# Altium project TimeDrive.PrjPcb (part 2 of 2)

## Sheet 12-UWB-Power.SchDoc
size A; SheetNumber: 12; SheetTotal: 16
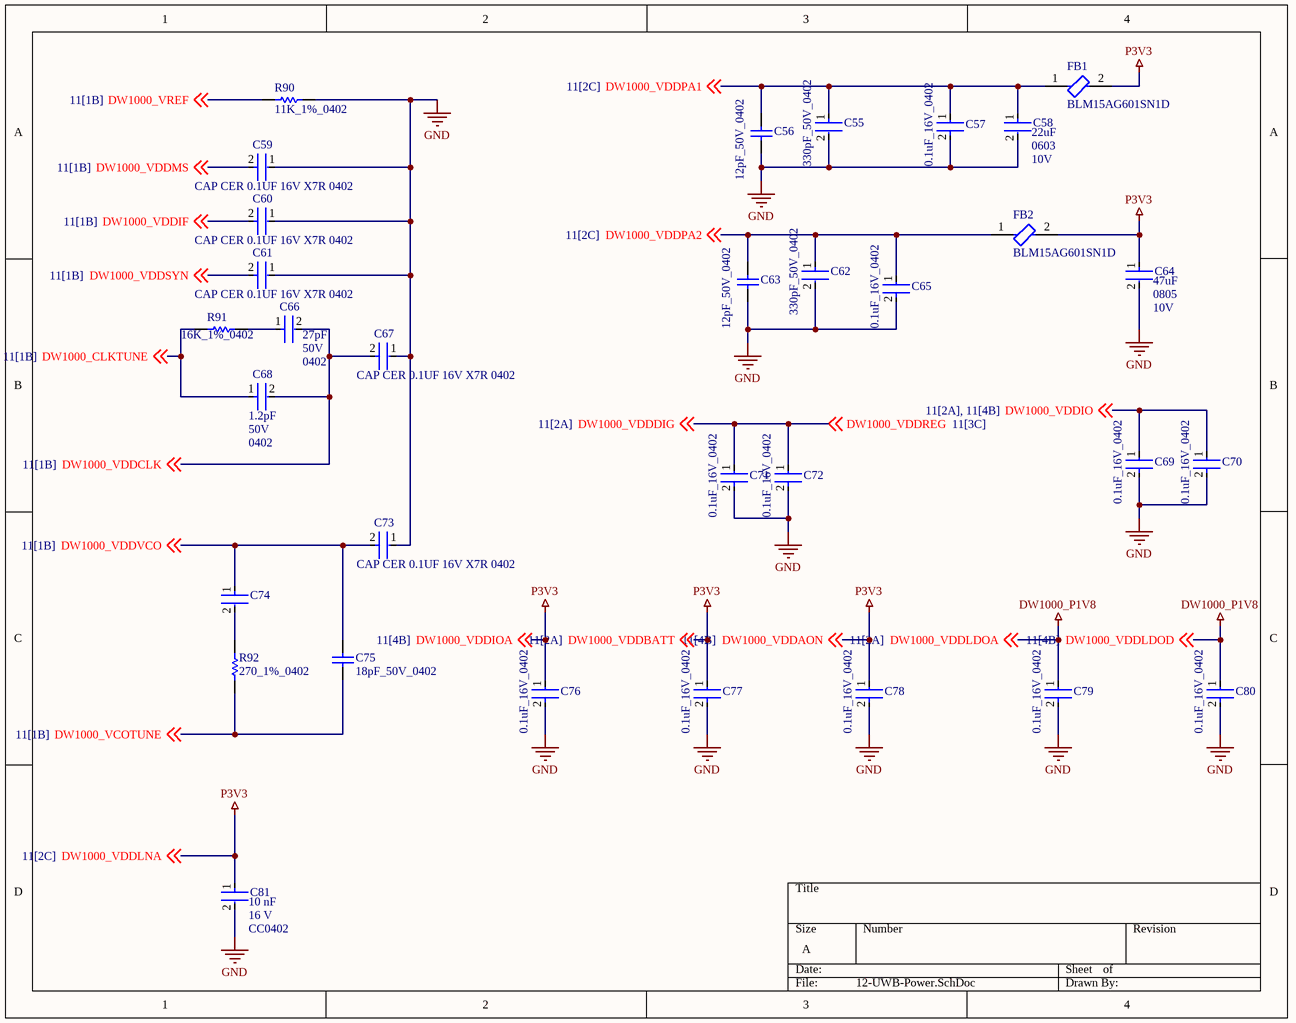
[diagram p6: 12-UWB-Power.SchDoc]

### Parts
C55  330pF_50V_0402  [FP-GRM155-0_05-MFG]
C56  12pF_50V_0402  [CAPC1005X55X25LL05T05]
C57  0.1uF_16V_0402  [FP-GRM15-MFG]
C58  Capacitance: 22uF  Voltage Rating: 10V  Case Code (Imperial): 0603  [FP-GRM188-0_2-IPC_C]  (hidden comment: GRM188R61A226ME15D)
C59  GRM155R71C104KA88D  [FP-GRM15-MFG]  (value not drawn)
C60  GRM155R71C104KA88D  [FP-GRM15-MFG]  (value not drawn)
C61  GRM155R71C104KA88D  [FP-GRM15-MFG]  (value not drawn)
C62  330pF_50V_0402  [FP-GRM155-0_05-MFG]
C63  12pF_50V_0402  [CAPC1005X55X25LL05T05]
C64  Capacitance: 47uF  Case Code (Imperial): 0805  Voltage: 10V  [FP-GRM21B-0_2-e0_2_0_7-IPC_A]  (hidden comment: GRM21BR61A476ME15L)
C65  0.1uF_16V_0402  [FP-GRM15-MFG]
C66  Voltage Rating: 50V  Case/Package: 0402  Capacitance: 27pF  [FP-0402-L_1_0_1-W_0_5_0_1-MFG]  (hidden comment: 04025A270JAT2A)
C67  GRM155R71C104KA88D  [FP-GRM15-MFG]  (value not drawn)
C68  Voltage Rating (DC): 50V  Case Code (Imperial): 0402  Capacitance: 1.2pF  [FP-GJM155-0_05-IPC_B]  (hidden comment: GJM1555C1H1R2BB01D)
C69  0.1uF_16V_0402  [FP-GRM15-MFG]
C70  0.1uF_16V_0402  [FP-GRM15-MFG]
C71  0.1uF_16V_0402  [FP-GRM15-MFG]
C72  0.1uF_16V_0402  [FP-GRM15-MFG]
C73  GRM155R71C104KA88D  [FP-GRM15-MFG]  (value not drawn)
C74  C0402C821K5RACTU  [FP-C0402-BB-MFG]  (value not drawn)
C75  18pF_50V_0402  [CAPC1005X55X25NL05T10]
C76  0.1uF_16V_0402  [FP-GRM15-MFG]
C77  0.1uF_16V_0402  [FP-GRM15-MFG]
C78  0.1uF_16V_0402  [FP-GRM15-MFG]
C79  0.1uF_16V_0402  [FP-GRM15-MFG]
C80  0.1uF_16V_0402  [FP-GRM15-MFG]
C81  value 10 nF  Package: CC0402  Voltage Rating: 16 V  [FP-CC0402-MFG]  (hidden comment: CC0402KRX7R7BB103)
FB1  BLM15AG601SN1D  [FP-BLM15-0_05-MFG]
FB2  BLM15AG601SN1D  [FP-BLM15-0_05-MFG]
R90  11K_1%_0402  [RESC1005X40X25LL05T10]
R91  16K_1%_0402  [RESC1005X40X25ML05T10]
R92  270_1%_0402  [RESC1005X40X25ML05T05]

### Nets
DW1000_P1V8: C79.1 C80.1 ; off-sheet DW1000_VDDLDOD, off-sheet DW1000_VDDLDOA  [also labelled DW1000_VDDLDOA, DW1000_VDDLDOD]
GND: C55.2 C56.1 C57.2 C58.2 C59.1 C60.1 C61.1 C62.2 C63.1 C64.2 C65.2 C67.1 C69.2 C70.2 C71.2 C72.2 C73.1 C76.2 C77.2 C78.2 C79.2 C80.2 C81.2 R90.2
P3V3: C64.1 C76.1 C77.1 C78.1 C81.1 FB1.2 FB2.2 ; off-sheet DW1000_VDDLNA, off-sheet DW1000_VDDAON, off-sheet DW1000_VDDIOA, off-sheet DW1000_VDDBATT  [also labelled DW1000_VDDAON, DW1000_VDDBATT, DW1000_VDDIOA, DW1000_VDDLNA]
DW1000_CLKTUNE: C68.1 R91.1 ; off-sheet DW1000_CLKTUNE
DW1000_VCOTUNE: C75.1 R92.1 ; off-sheet DW1000_VCOTUNE
DW1000_VDDCLK: C66.2 C67.2 C68.2 ; off-sheet DW1000_VDDCLK
DW1000_VDDDIG: C71.1 C72.1 ; off-sheet DW1000_VDDREG, off-sheet DW1000_VDDDIG  [also labelled DW1000_VDDREG]
DW1000_VDDIF: C60.2 ; off-sheet DW1000_VDDIF
DW1000_VDDIO: C69.1 C70.1 ; off-sheet DW1000_VDDIO
DW1000_VDDMS: C59.2 ; off-sheet DW1000_VDDMS
DW1000_VDDPA1: C55.1 C56.2 C57.1 C58.1 FB1.1 ; off-sheet DW1000_VDDPA1
DW1000_VDDPA2: C62.1 C63.2 C65.1 FB2.1 ; off-sheet DW1000_VDDPA2
DW1000_VDDSYN: C61.2 ; off-sheet DW1000_VDDSYN
DW1000_VDDVCO: C73.2 C74.1 C75.2 ; off-sheet DW1000_VDDVCO
DW1000_VREF: R90.1 ; off-sheet DW1000_VREF
NetC66_1: C66.1 R91.2
NetC74_2: C74.2 R92.2

### Library data of the parts
C55 C62 = CMP-06035-004830-1: Chip Multilayer Ceramic Capacitors for General Purpose, 0402, 330pF, C0G, 30ppm/°C, 5%, 50V; Insulation Resistance: 10GR; REACH SVHC: No SVHC; Depth: 0.5mm; Voltage Rating (DC): 50V; Number of Pins: 2; Max Operating Temperature: 125°C; Dielectric: C0G; Tolerance: 5%; Package Quantity: 1; Length: 1mm; Thickness: 0.022inch; Case/Package: 0402; Lead Free: Lead Free; Case Code (Imperial): 0402; Material: Ceramic; Voltage Rating: 50V; Voltage: 50V; Radiation Hardening: No; Min Operating Temperature: -55°C; Packaging: Tape and Reel; Capacitance: 330pF; Case Code (Metric): 1005; Width: 0.5mm; Mount: Surface Mount; Height: 0.5mm; Temperature Coefficient: 30ppm/°C; Termination: SMD/SMT
C56 C63 = CMP-2000-06069-1: Chip Capacitor, 12 pF, +/- 5%, 50 V, -55 to 125 degC, 0402 (1005 Metric), RoHS, Tape and Reel; Manufacturer: Yageo; Capacitance: 12pF; Voltage - Rated: 50V; Other Names: 311-1016-6311-1266-6311-1266-6-ND; Catalog Drawings: CC_0402; Featured Product: CommodityMultilayerCeramicCapacitors–CCSeries; Product Training Modules: MultilayerCeramicCapacitors; Online Catalog: CCSeries; Temperature Coefficient: C0G,NP0; Mounting Technology: SurfaceMount; Package Reference: 0402; Lead Style: -; Datasheet URL: http://www.yageo.com/NewPortal/yageodocoutput?fileName=/pdf/MLCC/UPY-GP_NP0_16V-to-50V_14.pdf; Height - Seated (Max): -; Mounting Type: SurfaceMount,MLCC; Series: CC; Standard Package: 1; Manufacturer URL: http://www.yageo.com/; Package / Case: 0402(1005Metric); Features: -; Applications: GeneralPurpose; Family: CeramicCapacitors; Size / Dimension: 0.039"Lx0.020"W(1.00mmx0.50mm); Ratings: -; Package Description: 2-Pin Surface Mount Device, Body 1 x 0.5 mm; Datasheet Version: Rev. 14, 07/2016; Lead Spacing: -; Packaging: Digi-Reel®; Category: Capacitors; Tolerance: ±5%; Thickness (Max): 0.022"(0.55mm); Operating Temperature: -55°C~125°C
C57 C65 C69-C72 C76-C80 = CMP-2100-03641-2: Manufacturer Part Number: GRM155R71C104KA88D; Manufacturer: Murata; Temperature Characteristic: X7R; Standoff Height: 0mm; Tolerance: 10%; Voltage Rating: 16Vdc; Material: Ceramic; Capacitance: 0.10μF; Value: 0.10μF; RoHS: TRUE; Octopart: https://octopart.com/grm155r71c104ka88d-murata-196880; Digikey Description: CAP CER 0.1UF 16V X7R 0402; Device Class L3: Ceramic Capacitors; Height: 0.55mm; ComponentLink2Description: Datasheet; Temperature Range Low: -55°C; Ipc Land Pattern Name: CAPC10050X219; ComponentLink2URL: https://search.murata.co.jp/Ceramy/image/img/A01X/G101/ENG/GRM155R71H471KA01-01A.pdf; Device Class L1: Passive Components; Lead Free: yes; Category: Cap; Package: GRM15; Temperature: -55°C to +125°C; Device Class L2: Capacitors; Temperature Range High: +125°C; Mouser Description: 0402 0.1 uF 16V ±10 % Tolerance X7R SMT Multilayer Ceramic Capacitor
C58 = CMP-2000-06337-3: Chip Multilayer Ceramic Capacitors for General Purpose, 0603, 22uF, X5R, 15%, 20%, 10V; Tolerance: 20%; Weight: 0.000222oz; Material: Ceramic; Depth: 0.8mm; Length: 1.6mm; Termination: SMD/SMT; Packaging: Tape and Reel; Width: 0.8mm; Mount: Surface Mount; Voltage Rating (DC): 10V; Case/Package: 0603; Thickness: 0.039inch; REACH SVHC: No SVHC; Dielectric: X5R; Height: 0.8mm; Package Quantity: 4000; Case Code (Metric): 1608; Min Operating Temperature: -55°C; Lead Free: Lead Free; Max Operating Temperature: 85°C
C59-C61 C67 C73 = CMP-2100-03641-2: CAP CER 0.1UF 16V X7R 0402; Manufacturer: Murata; Standoff Height: 0mm; Tolerance: 10%; Voltage Rating: 16Vdc; Material: Ceramic; Capacitance: 0.10μF; Value: 0.10μF; RoHS: TRUE; Manufacturer Part Number: GRM155R71C104KA88D; Temperature Characteristic: X7R; Octopart: https://octopart.com/grm155r71c104ka88d-murata-196880; Digikey Description: CAP CER 0.1UF 16V X7R 0402; Device Class L3: Ceramic Capacitors; Height: 0.55mm; ComponentLink2Description: Datasheet; Temperature Range Low: -55°C; Ipc Land Pattern Name: CAPC10050X219; ComponentLink2URL: https://search.murata.co.jp/Ceramy/image/img/A01X/G101/ENG/GRM155R71H471KA01-01A.pdf; Device Class L1: Passive Components; Lead Free: yes; Category: Cap; Package: GRM15; Temperature: -55°C to +125°C; Device Class L2: Capacitors; Temperature Range High: +125°C; Mouser Description: 0402 0.1 uF 16V ±10 % Tolerance X7R SMT Multilayer Ceramic Capacitor
C64 = CMP-2000-06341-2: Chip Multilayer Ceramic Capacitors for General Purpose, 0805, 47uF, X5R, 15%, 20%, 10V; Dissipation Factor: 0.035%; Length: 2mm; Voltage Rating: 10V; Mount: Surface Mount; Width: 0.049inch; Voltage Rating (DC): 10V; Lead Free: Lead Free; REACH SVHC: No SVHC; Termination: SMD/SMT; Case/Package: 0805; Dielectric: X5R; Packaging: Tape and Reel; Max Operating Temperature: 85°C; Tolerance: 20%; Thickness: 0.057inch; Dielectric Material: Ceramic; Min Operating Temperature: -55°C; Height: 1.25mm; Case Code (Metric): 2012; Depth: 1.25mm
C66 = CMP-2008-02622-4: General Purpose Ceramic Capacitor, 0402, 27pF, 5%, C0G, 30ppm/°C, 50V; Voltage Rating (DC): 50V; Number of Pins: 2; Lead Free: Lead Free; RoHS Compliant: Yes; Dielectric Material: Ceramic; Height: 0.5mm; Voltage: 50V; Length: 1mm; Tolerance: 5%; Case Code (Imperial): 0402; Min Operating Temperature: -55°C; Max Operating Temperature: 125°C; Termination: SMD/SMT; Depth: 0.5mm; Width: 0.02inch; Dielectric: C0G; Radiation Hardening: No; Package Quantity: 1; Packaging: Tape and Reel; REACH SVHC: No SVHC; Thickness: 0.022inch; Temperature Coefficient: 0ppm/°C; Mount: Surface Mount; Case Code (Metric): 1005; Contact Plating: Tin
C68 = CMP-2008-03813-2: Multi-Layer Ceramic Capacitor 1.2pF C0G  ±0.1pF 0402 Paper T/R; Temperature Coefficient: 30ppm/°C; Case Code (Metric): 1005; Lead Free: Lead Free; Packaging: Tape and Reel; Radiation Hardening: No; Dielectric: C0G; Weight: 2.3E-05oz; Width: 0.5mm; Case/Package: 0402; Length: 1mm; Voltage Rating: 50V; Number of Pins: 2; Depth: 0.5mm; Thickness: 0.022inch; Voltage: 50V; Package Quantity: 10000; Max Operating Temperature: 125°C; Height: 0.5mm; REACH SVHC: No SVHC; Mount: Surface Mount; Min Operating Temperature: -55°C; Termination: SMD/SMT; Lead Pitch: 0.3mm
C74 = CMP-2008-03258-2: CAP CER 820PF 50V 10% X7R 0402; Manufacturer: Kemet; Temperature Coefficient: 15%; Tolerance: 0.1; Material: Ceramic; Lead Free: Yes; ComponentLink2Description: Datasheet; Manufacturer Part Number: C0402C821K5RACTU; Device Class L1: Passive Components; Device Class L2: Capacitors; ComponentLink2URL: https://content.kemet.com/datasheets/KEM_C1002_X7R_SMD.pdf; Temperature Range High: +125°C; Device Class L3: Ceramic Capacitors; Automotive: No; Value: 820 pF; Temperature Characteristic: X7R; Temperature Range Low: -55°C; Height: 0.55mm; Package: C0402-BB; Temperature: -55°C to +125°C; Capacitance: 820 pF; Category: Cap; Ipc Land Pattern Name: CAPC10050X50; Digikey Description: CAP CER 820PF 50V 10% X7R 0402; RoHS: TRUE; Octopart: https://octopart.com/c0402c821k5ractu-kemet-10304767; Mouser Description: Multilayer Ceramic Capacitors MLCC - SMD/SMT 50volts 820pF X7R 10%; Voltage Rating: 50 V
C75 = CMP-2008-03918-1: Part Number: GRM1555C1H180JA01D; Manufacturer: Murata
C81 = CMP-03422-000501-1: CAP CER 10000PF 16V X7R 0402; Manufacturer: YAGEO; Automotive Grade: NA; Material: Ceramic; Tolerance: 0.1; Temperature Coefficient: 30ppm/°C; Temperature Range Low: -55°C; Temperature Range High: +125°C; Mouser Description: 0402 10 nF 16 V ±10 % Tolerance X7R SMT Multilayer Ceramic Capacitor; Footprint Url: http://www.yageo.com/exep/pages/download/literatures/UPY-C_GEN_24.pdf; Category: Cap; RoHS: TRUE; Capacitance: 10 nF; Manufacturer Part Number: CC0402KRX7R7BB103; ComponentLink2Description: Datasheet; Ipc Land Pattern Name: CAPC10050X50; Automotive: No; ComponentLink2URL: http://www.yageo.com/documents/recent/UPY-GP_NP0_16V-to-50V_16.pdf; Device Class L1: Passive Components; Height: 0.55mm; Temperature Characteristic: X7R; Device Class L3: Ceramic Capacitors; Lead Free: Yes; Device Class L2: Capacitors; Digikey Description: CAP CER 10000PF 16V X7R 0402; Octopart: https://octopart.com/cc0402krx7r7bb103-yageo-192895; Temperature: -55°C to +125°C
FB1 FB2 = CMP-0686-00187-4: Chip Ferrite Bead, 0402, 600Ω @ 100MHz, 0.52Ω, 25%, 300mA; DC Resistance-Max: 600mR; Number of Lines: 1; DC Resistance (DCR): 520mR; Shielding: Unshielded; Impedance: 600R; Material: Steel; Frequency: 100MHz; Lead Free: Lead Free; Max DC Current: 300mA; Test Frequency: 100MHz; Depth: 0.55mm; Length: 1mm; Case Code (Imperial): 0402; Packaging: Tape and Reel; Height: 0.5mm; Max Operating Temperature: 125°C; Military Standard: Not; REACH SVHC: No SVHC; Case Code (Metric): 1005; Series: BLM15AG_SN; Core Material: Ferrite; Termination: SMD/SMT; DC Current: 300mA; Package Quantity: 10000; Width: 0.5mm; RoHS Compliant: Yes; Min Operating Temperature: -55°C; Current Rating: 300mA; Case/Package: 0402; Number of Pins: 2; Radiation Hardening: No; Tolerance: 25%; Number of Circuits: 1; Max Current Rating: 300mA
R90 = CMP-2002-07365-1: Manufacturer: Yageo / Phycomp; Part Number: RC0402FR-0711KL
R91 = CMP-2002-07038-1: Manufacturer: Yageo / Phycomp; Part Number: RC0402FR-0716KL
R92 = CMP-2002-08427-1: Part Number: CRCW0402270RFKED; Manufacturer: Vishay Dale

## Sheet 15-I225-MISC.SchDoc
size A; SheetNumber: 15; SheetTotal: 16
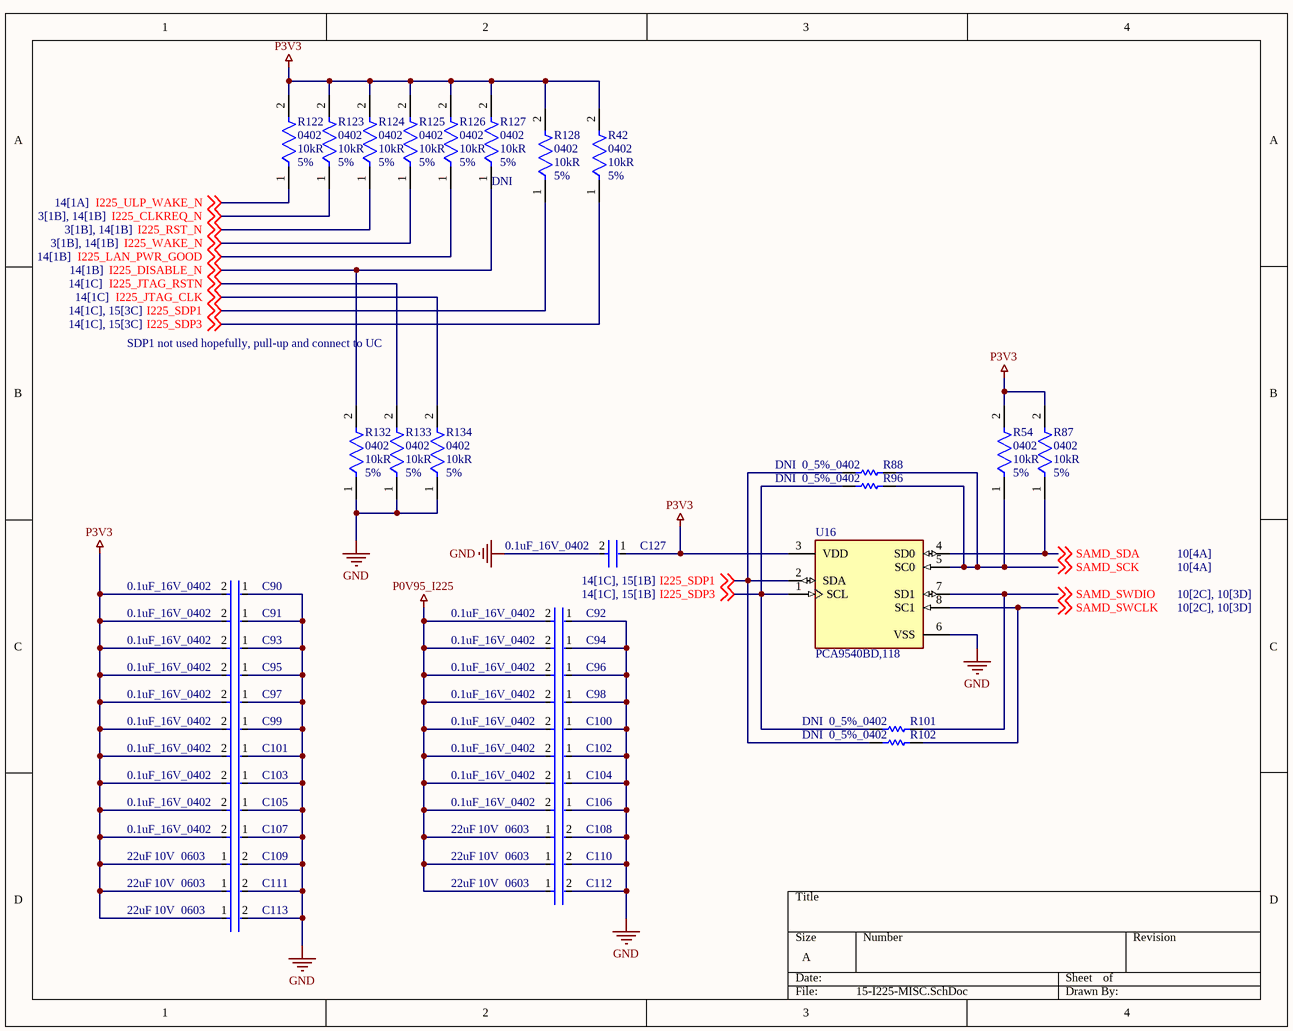
[diagram p7: 15-I225-MISC.SchDoc]

### Parts
C90  0.1uF_16V_0402  [FP-GRM15-MFG]
C91  0.1uF_16V_0402  [FP-GRM15-MFG]
C92  0.1uF_16V_0402  [FP-GRM15-MFG]
C93  0.1uF_16V_0402  [FP-GRM15-MFG]
C94  0.1uF_16V_0402  [FP-GRM15-MFG]
C95  0.1uF_16V_0402  [FP-GRM15-MFG]
C96  0.1uF_16V_0402  [FP-GRM15-MFG]
C97  0.1uF_16V_0402  [FP-GRM15-MFG]
C98  0.1uF_16V_0402  [FP-GRM15-MFG]
C99  0.1uF_16V_0402  [FP-GRM15-MFG]
C100  0.1uF_16V_0402  [FP-GRM15-MFG]
C101  0.1uF_16V_0402  [FP-GRM15-MFG]
C102  0.1uF_16V_0402  [FP-GRM15-MFG]
C103  0.1uF_16V_0402  [FP-GRM15-MFG]
C104  0.1uF_16V_0402  [FP-GRM15-MFG]
C105  0.1uF_16V_0402  [FP-GRM15-MFG]
C106  0.1uF_16V_0402  [FP-GRM15-MFG]
C107  0.1uF_16V_0402  [FP-GRM15-MFG]
C108  Capacitance: 22uF  Voltage Rating: 10V  Case Code (Imperial): 0603  [FP-GRM188-0_2-IPC_C]  (hidden comment: GRM188R61A226ME15D)
C109  Capacitance: 22uF  Voltage Rating: 10V  Case Code (Imperial): 0603  [FP-GRM188-0_2-IPC_C]  (hidden comment: GRM188R61A226ME15D)
C110  Capacitance: 22uF  Voltage Rating: 10V  Case Code (Imperial): 0603  [FP-GRM188-0_2-IPC_C]  (hidden comment: GRM188R61A226ME15D)
C111  Capacitance: 22uF  Voltage Rating: 10V  Case Code (Imperial): 0603  [FP-GRM188-0_2-IPC_C]  (hidden comment: GRM188R61A226ME15D)
C112  Capacitance: 22uF  Voltage Rating: 10V  Case Code (Imperial): 0603  [FP-GRM188-0_2-IPC_C]  (hidden comment: GRM188R61A226ME15D)
C113  Capacitance: 22uF  Voltage Rating: 10V  Case Code (Imperial): 0603  [FP-GRM188-0_2-IPC_C]  (hidden comment: GRM188R61A226ME15D)
C127  0.1uF_16V_0402  [FP-GRM15-MFG]
R42  Case/Package: 0402  Resistance: 10kR  Tolerance: 5%  [FP-CRCW0402-e3-IPC_B]  (hidden comment: CRCW040210K0JNED)
R54  Case/Package: 0402  Resistance: 10kR  Tolerance: 5%  [FP-CRCW0402-e3-IPC_B]  (hidden comment: CRCW040210K0JNED)
R87  Case/Package: 0402  Resistance: 10kR  Tolerance: 5%  [FP-CRCW0402-e3-IPC_B]  (hidden comment: CRCW040210K0JNED)
R88  0_5%_0402  [RESC1005X40X25LL10T10]  (no BOM)
R96  0_5%_0402  [RESC1005X40X25LL10T10]  (no BOM)
R101  0_5%_0402  [RESC1005X40X25LL10T10]  (no BOM)
R102  0_5%_0402  [RESC1005X40X25LL10T10]  (no BOM)
R122  Case/Package: 0402  Resistance: 10kR  Tolerance: 5%  [FP-CRCW0402-e3-IPC_B]  (hidden comment: CRCW040210K0JNED)
R123  Case/Package: 0402  Resistance: 10kR  Tolerance: 5%  [FP-CRCW0402-e3-IPC_B]  (hidden comment: CRCW040210K0JNED)
R124  Case/Package: 0402  Resistance: 10kR  Tolerance: 5%  [FP-CRCW0402-e3-IPC_B]  (hidden comment: CRCW040210K0JNED)
R125  Case/Package: 0402  Resistance: 10kR  Tolerance: 5%  [FP-CRCW0402-e3-IPC_B]  (hidden comment: CRCW040210K0JNED)
R126  Case/Package: 0402  Resistance: 10kR  Tolerance: 5%  [FP-CRCW0402-e3-IPC_B]  (hidden comment: CRCW040210K0JNED)
R127  Case/Package: 0402  Resistance: 10kR  Tolerance: 5%  [FP-CRCW0402-e3-IPC_B]  (hidden comment: CRCW040210K0JNED)  (no BOM)
R128  Case/Package: 0402  Resistance: 10kR  Tolerance: 5%  [FP-CRCW0402-e3-IPC_B]  (hidden comment: CRCW040210K0JNED)
R132  Case/Package: 0402  Resistance: 10kR  Tolerance: 5%  [FP-CRCW0402-e3-IPC_B]  (hidden comment: CRCW040210K0JNED)
R133  Case/Package: 0402  Resistance: 10kR  Tolerance: 5%  [FP-CRCW0402-e3-IPC_B]  (hidden comment: CRCW040210K0JNED)
R134  Case/Package: 0402  Resistance: 10kR  Tolerance: 5%  [FP-CRCW0402-e3-IPC_B]  (hidden comment: CRCW040210K0JNED)
U16  PCA9540BD,118  [FP-SOT96-1-MFG]

### Nets
GND: C90.1 C91.1 C92.1 C93.1 C94.1 C95.1 C96.1 C97.1 C98.1 C99.1 C100.1 C101.1 C102.1 C103.1 C104.1 C105.1 C106.1 C107.1 C108.2 C109.2 C110.2 C111.2 C112.2 C113.2 C127.2 R132.1 R133.1 R134.1 U16.6(VSS)
P0V95_I225: C92.2 C94.2 C96.2 C98.2 C100.2 C102.2 C104.2 C106.2 C108.1 C110.1 C112.1
P3V3: C90.2 C91.2 C93.2 C95.2 C97.2 C99.2 C101.2 C103.2 C105.2 C107.2 C109.1 C111.1 C113.1 C127.1 R42.2 R54.2 R87.2 R122.2 R123.2 R124.2 R125.2 R126.2 R127.2 R128.2 U16.3(VDD)
I225_CLKREQ_N: R123.1 ; off-sheet I225_CLKREQ_N
I225_DISABLE_N: R127.1 R132.2 ; off-sheet I225_DISABLE_N
I225_JTAG_CLK: R134.2 ; off-sheet I225_JTAG_CLK
I225_JTAG_RSTN: R133.2 ; off-sheet I225_JTAG_RSTN
I225_LAN_PWR_GOOD: R126.1 ; off-sheet I225_LAN_PWR_GOOD
I225_RST_N: R124.1 ; off-sheet I225_RST_N
I225_SDP1: R88.1 R102.1 R128.1 U16.2(SDA) ; off-sheet I225_SDP1
I225_SDP3: R42.1 R96.1 R101.1 U16.1(SCL) ; off-sheet I225_SDP3
I225_ULP_WAKE_N: R122.1 ; off-sheet I225_ULP_WAKE_N
I225_WAKE_N: R125.1 ; off-sheet I225_WAKE_N
SAMD_SCK: R54.1 R88.2 R96.2 U16.5(SC0) ; off-sheet SAMD_SCK
SAMD_SDA: R87.1 U16.4(SD0) ; off-sheet SAMD_SDA
SAMD_SWCLK: R102.2 U16.8(SC1) ; off-sheet SAMD_SWCLK
SAMD_SWDIO: R101.2 U16.7(SD1) ; off-sheet SAMD_SWDIO

### Notes on the sheet
- SDP1 not used hopefully, pull-up and connect to UC

### Library data of the parts
C90-C107 C127 = CMP-2100-03641-2: CAP CER 0.1UF 16V X7R 0402; Manufacturer Part Number: GRM155R71C104KA88D; Manufacturer: Murata; Standoff Height: 0mm; Tolerance: 10%; Voltage Rating: 16Vdc; Material: Ceramic; Capacitance: 0.10μF; Value: 0.10μF; RoHS: TRUE; Temperature Characteristic: X7R; Octopart: https://octopart.com/grm155r71c104ka88d-murata-196880; Digikey Description: CAP CER 0.1UF 16V X7R 0402; Device Class L3: Ceramic Capacitors; Height: 0.55mm; ComponentLink2Description: Datasheet; Temperature Range Low: -55°C; Ipc Land Pattern Name: CAPC10050X219; ComponentLink2URL: https://search.murata.co.jp/Ceramy/image/img/A01X/G101/ENG/GRM155R71H471KA01-01A.pdf; Device Class L1: Passive Components; Lead Free: yes; Category: Cap; Package: GRM15; Temperature: -55°C to +125°C; Device Class L2: Capacitors; Temperature Range High: +125°C; Mouser Description: 0402 0.1 uF 16V ±10 % Tolerance X7R SMT Multilayer Ceramic Capacitor
C108-C113 = CMP-2000-06337-3: as C58 on sheet 12-UWB-Power; Tolerance: 20%; Weight: 0.000222oz; Material: Ceramic; Depth: 0.8mm; Length: 1.6mm; Termination: SMD/SMT; Packaging: Tape and Reel; Width: 0.8mm; Mount: Surface Mount; Voltage Rating (DC): 10V; Case/Package: 0603; Thickness: 0.039inch; REACH SVHC: No SVHC; Dielectric: X5R; Height: 0.8mm; Package Quantity: 4000; Case Code (Metric): 1608; Min Operating Temperature: -55°C; Lead Free: Lead Free; Max Operating Temperature: 85°C
R42 R54 R87 R122-R128 R132-R134 = CMP-2002-08136-3: RES Thick Film, 10kΩ, 5%, 0.063W, 200ppm/°C, 0402; Voltage Rating: 50V; Power Rating: 63mW; Military Standard: Not; Packaging: Tape and Reel; Case Code (Imperial): 0402; Min Operating Temperature: -55°C; Case Code (Metric): 1005; Temperature Coefficient: 200ppm/°C; Termination: SMD/SMT; Composition: Thick Film; Depth: 0.5mm; Number of Terminations: 2; Contact Plating: Tin; Height: 0.016inch; Width: 0.5mm; Max Operating Temperature: 155°C; Features: Automotive AEC-Q200; Length: 1mm; Radiation Hardening: No; Max Power Dissipation: 63mW; Mount: Surface Mount; Package Quantity: 1; Weight: 2.3E-05oz
  R127: DNI: DNI
R88 R96 R101 R102 = CMP-2002-04569-1: Manufacturer: KOA Speer; Part Number: RK73Z1ETTP; DNI: DNI
U16 = CMP-10118-000002-1: IC INTERFACE SPECIALIZED 8SO; Logic Function: Multiplexer; Max Frequency: 400kHz; Interface: I2C; Operating Supply Voltage: 5V; Number of Input Lines: 2; Min Supply Voltage: 2.3V; Number of Outputs: 1; On-State Resistance: 55R; Power Dissipation: 400mW; Max Supply Current: 65uA; Low Level Output Current: 6mA; Propagation Delay: 0.3ns; Max Supply Voltage: 5.5V; Number of Pins: 8; Packaging: Tape and Reel; Height: 1.45mm; Contact Plating: Gold; Weight: 0.01787oz; Package Quantity: 1; Number of Output Lines: 1; Lead Free: Lead Free; Radiation Hardening: No; Mount: Surface Mount; Quiescent Current: 65uA; Max Operating Temperature: 85°C; Number of Inputs: 2; Width: 4mm; Case/Package: SO; Min Operating Temperature: -40°C; Length: 5mm

## Sheet 16-Power.SchDoc
size A; SheetNumber: 16; SheetTotal: 16
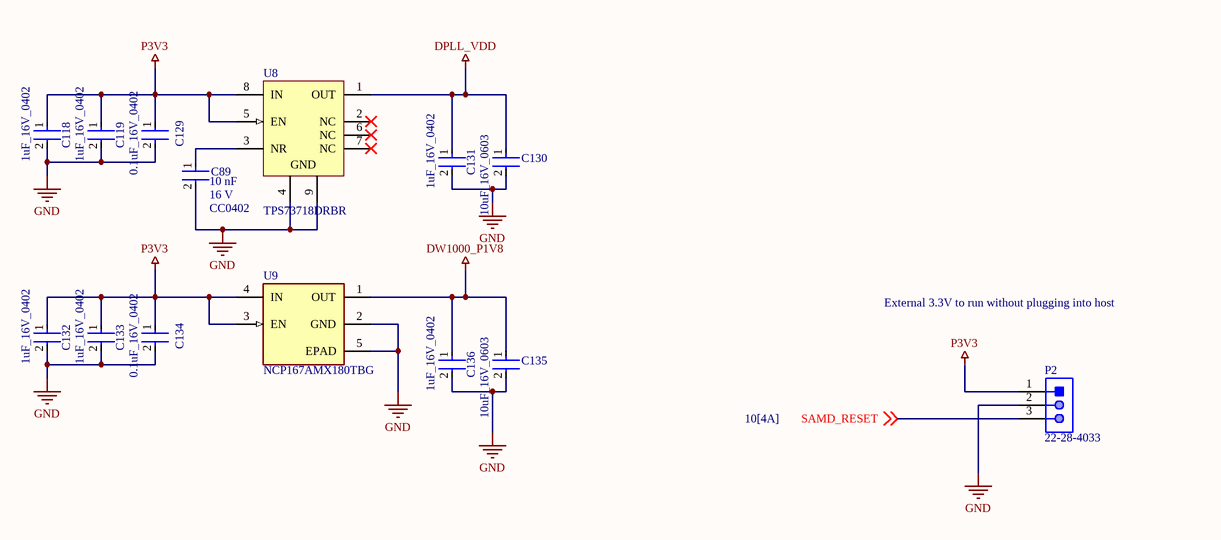
[diagram p8: 16-Power.SchDoc]

### Parts
C89  value 10 nF  Package: CC0402  Voltage Rating: 16 V  [FP-CC0402-MFG]  (hidden comment: CC0402KRX7R7BB103)
C118  1uF_16V_0402  [FP-0402-L_1_0_0_05-W_0_5-IPC_C]
C119  1uF_16V_0402  [FP-0402-L_1_0_0_05-W_0_5-IPC_C]
C129  0.1uF_16V_0402  [FP-GRM15-MFG]
C130  10uF_16V_0603  [FP-MK107BA-IPC_A]
C131  1uF_16V_0402  [FP-0402-L_1_0_0_05-W_0_5-IPC_C]
C132  1uF_16V_0402  [FP-0402-L_1_0_0_05-W_0_5-IPC_C]
C133  1uF_16V_0402  [FP-0402-L_1_0_0_05-W_0_5-IPC_C]
C134  0.1uF_16V_0402  [FP-GRM15-MFG]
C135  10uF_16V_0603  [FP-MK107BA-IPC_A]
C136  1uF_16V_0402  [FP-0402-L_1_0_0_05-W_0_5-IPC_C]
P2  22-28-4033  [MOLX-22-28-4033_V]
U8  TPS73718DRBR  [DRB0008A_V]
U9  NCP167AMX180TBG  [FP-711AJ-MFG]

### Nets
DPLL_VDD: C130.1 C131.1 U8.1(OUT)
DW1000_P1V8: C135.1 C136.1 U9.1(OUT)
GND: C89.2 C118.2 C119.2 C129.2 C130.2 C131.2 C132.2 C133.2 C134.2 C135.2 C136.2 P2.2 U8.4(GND) U8.9(GND) U9.2(GND) U9.5(EPAD)
P3V3: C118.1 C119.1 C129.1 C132.1 C133.1 C134.1 P2.1 U8.5(EN) U8.8(IN) U9.3(EN) U9.4(IN)
SAMD_RESET: P2.3 ; off-sheet SAMD_RESET
NetC89_1: C89.1 U8.3(NR)

Not connected (* = marked no-connect by the designer): U8 2(NC)* 6(NC)* 7(NC)*

### Notes on the sheet
- External 3.3V to run without plugging into host

### Library data of the parts
C89 = CMP-03422-000501-1: as C81 on sheet 12-UWB-Power; Temperature Range Low: -55°C; Temperature Range High: +125°C; Mouser Description: 0402 10 nF 16 V ±10 % Tolerance X7R SMT Multilayer Ceramic Capacitor; Footprint Url: http://www.yageo.com/exep/pages/download/literatures/UPY-C_GEN_24.pdf; Category: Cap; RoHS: TRUE; Capacitance: 10 nF; Manufacturer Part Number: CC0402KRX7R7BB103; ComponentLink2Description: Datasheet; Ipc Land Pattern Name: CAPC10050X50; Automotive: No; ComponentLink2URL: http://www.yageo.com/documents/recent/UPY-GP_NP0_16V-to-50V_16.pdf; Device Class L1: Passive Components; Height: 0.55mm; Temperature Characteristic: X7R; Device Class L3: Ceramic Capacitors; Lead Free: Yes; Device Class L2: Capacitors; Digikey Description: CAP CER 10000PF 16V X7R 0402; Octopart: https://octopart.com/cc0402krx7r7bb103-yageo-192895; Temperature: -55°C to +125°C
C118 C119 C131-C133 C136 = CMP-14477-003537-2: None; Tolerance: 20%; Voltage Rating (DC): 16V; Capacitance: 1uF; Dielectric: X5R; Height: 0.5mm; Package Quantity: 10000; Series: M; Max Operating Temperature: 85°C; Width: 0.02inch; Mount: Surface Mount; Thickness: 0.022inch; Length: 1mm; Min Operating Temperature: -55°C; Depth: 0.5mm; RoHS Compliant: Yes; Construction: Flat; Case/Package: 0402; Radiation Hardening: No; Packaging: Tape and Reel; Voltage: 16V; Voltage Rating: 16V; Halogen Free: Halogen Free
C129 C134 = CMP-2100-03641-2: as C90 on sheet 15-I225-MISC; RoHS: TRUE; Temperature Characteristic: X7R; Octopart: https://octopart.com/grm155r71c104ka88d-murata-196880; Digikey Description: CAP CER 0.1UF 16V X7R 0402; Device Class L3: Ceramic Capacitors; Height: 0.55mm; ComponentLink2Description: Datasheet; Temperature Range Low: -55°C; Ipc Land Pattern Name: CAPC10050X219; ComponentLink2URL: https://search.murata.co.jp/Ceramy/image/img/A01X/G101/ENG/GRM155R71H471KA01-01A.pdf; Device Class L1: Passive Components; Lead Free: yes; Category: Cap; Package: GRM15; Temperature: -55°C to +125°C; Device Class L2: Capacitors; Temperature Range High: +125°C; Mouser Description: 0402 0.1 uF 16V ±10 % Tolerance X7R SMT Multilayer Ceramic Capacitor
C130 C135 = CMP-2000-06226-3: None; Dielectric: X5R; Voltage Rating: 16V; Tolerance: 20%; Capacitance: 10uF; Packaging: Tape and Reel; Mount: Surface Mount; Height: 0.8mm; Series: M; Min Operating Temperature: -55°C; Max Operating Temperature: 85°C; Thickness: 0.031inch; Construction: Flat; Case/Package: 0603; Case Code (Metric): 1608; Package Quantity: 1; Case Code (Imperial): 0603; Voltage Rating (DC): 16V; Halogen Free: Halogen Free; Length: 0.063inch; Width: 0.031inch; Termination: SMD/SMT; RoHS Compliant: Yes
P2 = CMP-1676-00001-5: Male Header, Pitch 2.54 mm, 1 x 3 Position, Height 8.38 mm, Tail Length 3.18 mm, RoHS, Bulk; Manufacturer: Molex; Rows: 1; Voltage Rating: 250 V; Current Rating: 4 A; Min Operating Temperature: 0 degC; Lead Pitch: 0.1 inch; Packaging: Bulk; Contact Finish: Gold; RoHSCompliant: true; Contact Material: Brass; PackageReference: 22-28-4033; REACH SVHC: Unknown; PackageDescription: Male Header, Pitch 2.54 mm, 1 x 3 Position, Height 8.38 mm, Tail Length 3.18 mm; ComponentLink2URL: http://www.molex.com/pdm_docs/sd/022284033_sd.pdf; Height: 8.38 mm; Mounting Technology: Through Hole; ComponentLink1Description: Manufacturer URL; Length: 7.62 mm; Mount: Through Hole; DatasheetVersion: Rev. G, 01/2012; Max Operating Temperature: 75 degC; ComponentLink2Description: Datasheet; Colour: Black; Pins: 3; Contact Plating: Gold; Package Quantity: 1; ComponentLink1URL: http://www.molex.com/
U8 = CMP-0395-00613-2: Single Output LDO, 1 A, Fixed 1.8 V Output, 2.2 to 5.5 V Input, with Reverse Current Protection, 8-pin SON (DRB), -40 to 125 degC, Green (RoHS & no Sb/Br); Manufacturer: Texas Instruments; Fixed Output Options(V): 1.8; Vin(Min)(V): 2.2; Iq(Typ)(mA): 0.3; Accuracy(%): 3; Vdo(Typ)(mV): 130; SubFamily: Single Channel LDO; Vin(Max)(V): 5.5; Iout(Max)(A): 1; Rating: Catalog; Vout Adj(Min)(V): 1.8; ComponentLink2Description: Datasheet; PartNumber: TPS73718DRBR; Vout Adj(Max)(V): 1.8; ComponentLink3URL: http://www.ti.com/litv/pdf/mpds118h; PackageDescription: 8-Pin Plastic Small Outline, Body 3 x 3 mm, Pitch 0.65 mm; ComponentLink1Description: Manufacturer URL; ComponentLink1URL: http://www.ti.com/; ComponentLink3Description: Package Specification; PackageVersion: 4203482-2/K; Eco-Plan: Green (RoHS & no Sb/Br); PackageReference: DRB0008A; Mounting Technology: Surface Mount; ComponentLink2URL: http://www.ti.com/general/docs/lit/getliterature.tsp?genericPartNumber=TPS73718&fileType=pdf; DatasheetVersion: SBVS067O
U9 = CMP-07128-000018-1: LDO 700 MA ULTRA-LOW NOI; Manufacturer: ON Semiconductor; Accuracy Percentage: 2%; Output Type: Fixed; Output Current: 700mA; Number Of Outputs: 1; Min Supply Voltage: 1.9V; Dropout Voltage: 190mV; Output Voltage: 1.8V; Standoff Height: 0mm; Max Supply Voltage: 5.5V; Max Junction Temp: +150°C; Nominal Supply Current: 9.7uA; Device Class L1: Integrated Circuits (ICs); Octopart: https://octopart.com/ncp167amx330tbg-on+semiconductor-85869721; Footprint Url: https://www.onsemi.com/pub/Collateral/711AJ.PDF; Height: 0.43mm; ComponentLink2Description: Datasheet; Temperature Range High: +150°C; Lead Free: Yes; Package: 711AJ; Device Class L3: Voltage Regulators - Linear; ComponentLink2URL: https://www.onsemi.com/pub/Collateral/NCP167-D.PDF; Temperature: to +150°C; Category: IC; Device Class L2: Power Management ICs; Digikey Description: LDO 700 MA ULTRA-LOW NOI; Manufacturer Part Number: NCP167AMX180TBG; Automotive: No; RoHS: TRUE

## Nets that join several sheets
DW1000_P1V8: 12-UWB-Power (C79.1 C80.1), 16-Power (C135.1 C136.1 U9.1)
GND: 03-M2Finger (15 pins), 05-AD9546_StrapsXtal (13 pins), 06-AD9546_TimestampInputs (28 pins), 09-AD9513-2 (33 pins), 10-Microcontroller-1 (20 pins), 12-UWB-Power (24 pins), 15-I225-MISC (29 pins), 16-Power (16 pins)
P3V3: 03-M2Finger (10 pins), 05-AD9546_StrapsXtal (13 pins), 06-AD9546_TimestampInputs (10 pins), 09-AD9513-2 (24 pins), 10-Microcontroller-1 (17 pins), 12-UWB-Power (7 pins), 15-I225-MISC (25 pins), 16-Power (11 pins)
1PPS_5_P: 09-AD9513-2 (R53.2), 10-Microcontroller-1 (U10.19)
BUF_OE_N: 06-AD9546_TimestampInputs (8 pins), 09-AD9513-2 (R60.2 R141.2 U4.1 U4.7), 10-Microcontroller-1 (R129.1)
DPLL_RESETB: 05-AD9546_StrapsXtal (R12.1), 10-Microcontroller-1 (R65.1)
DPLL_SCLK: 05-AD9546_StrapsXtal (R70.1), 10-Microcontroller-1 (R59.1)
DPLL_SDIO: 05-AD9546_StrapsXtal (R72.1), 10-Microcontroller-1 (R63.1)
I225_CLKREQ_N: 03-M2Finger (R3.1), 15-I225-MISC (R123.1)
I225_RST_N: 03-M2Finger (R2.1), 15-I225-MISC (R124.1)
I225_WAKE_N: 03-M2Finger (R4.1), 15-I225-MISC (R125.1)
SAMD_RESET: 10-Microcontroller-1 (R44.2), 16-Power (P2.3)
SAMD_SCK: 10-Microcontroller-1 (U10.8), 15-I225-MISC (R54.1 R88.2 R96.2 U16.5)
SAMD_SDA: 10-Microcontroller-1 (U10.7), 15-I225-MISC (R87.1 U16.4)
SAMD_SWCLK: 10-Microcontroller-1 (J9.2 R45.1 R50.1), 15-I225-MISC (R102.2 U16.8)
SAMD_SWDIO: 10-Microcontroller-1 (J9.1 R46.1 R52.1), 15-I225-MISC (R101.2 U16.7)